# Altium schematic sheet SH5 - NETZER ENCODERS.SchDoc: Netzer Encoders
size B; CheckedBy: Lance Bantoto; DrawnBy: Kyle Hong; Engineer: Kyle Hong; Revision: 2; SheetNumber: 5; SheetTotal: 8
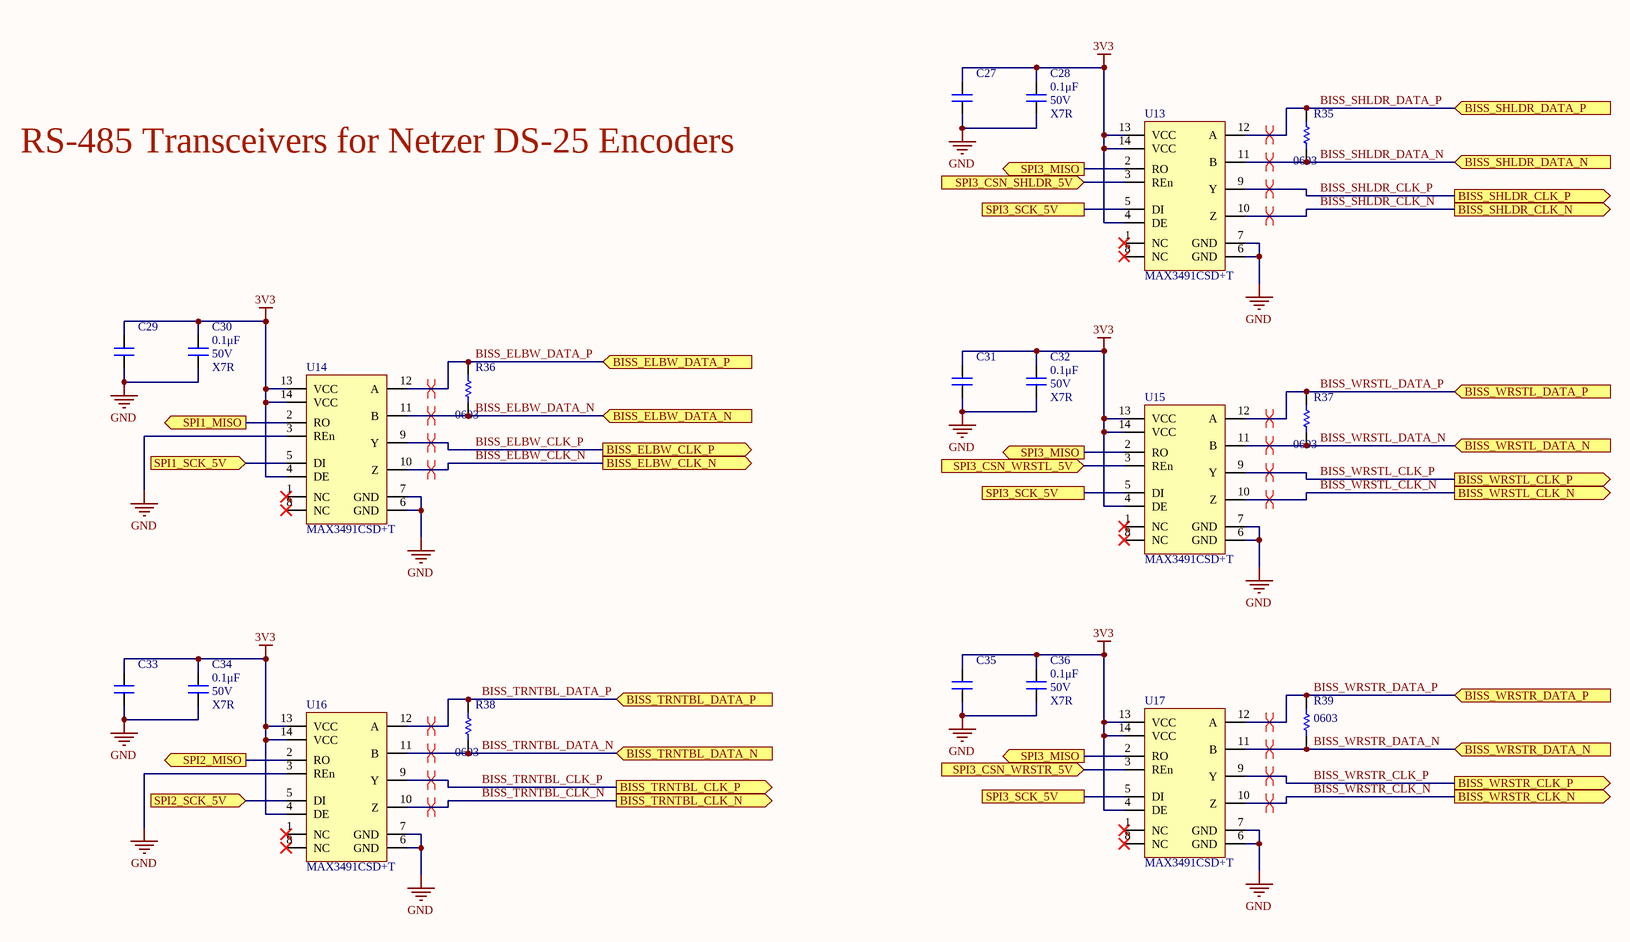
[diagram p0: SH5 - NETZER ENCODERS.SchDoc]

## Parts
C27  CAP_1uF_25V_0603  [CAP0603]  (value not drawn)
C28  value 0.1μF  Dielectric: X7R  Voltage Rating: 50V  [CAP0603]  (hidden comment: CAP_0.1uF_50V_0603)
C29  CAP_1uF_25V_0603  [CAP0603]  (value not drawn)
C30  value 0.1μF  Dielectric: X7R  Voltage Rating: 50V  [CAP0603]  (hidden comment: CAP_0.1uF_50V_0603)
C31  CAP_1uF_25V_0603  [CAP0603]  (value not drawn)
C32  value 0.1μF  Dielectric: X7R  Voltage Rating: 50V  [CAP0603]  (hidden comment: CAP_0.1uF_50V_0603)
C33  CAP_1uF_25V_0603  [CAP0603]  (value not drawn)
C34  value 0.1μF  Dielectric: X7R  Voltage Rating: 50V  [CAP0603]  (hidden comment: CAP_0.1uF_50V_0603)
C35  CAP_1uF_25V_0603  [CAP0603]  (value not drawn)
C36  value 0.1μF  Dielectric: X7R  Voltage Rating: 50V  [CAP0603]  (hidden comment: CAP_0.1uF_50V_0603)
R35  Package/Footprint: 0603  [RESC0603]  (hidden comment: RES_120Ω_0603_5%_HP)
R36  Package/Footprint: 0603  [RESC0603]  (hidden comment: RES_120Ω_0603_5%_HP)
R37  Package/Footprint: 0603  [RESC0603]  (hidden comment: RES_120Ω_0603_5%_HP)
R38  Package/Footprint: 0603  [RESC0603]  (hidden comment: RES_120Ω_0603_5%_HP)
R39  Package/Footprint: 0603  [RESC0603]  (hidden comment: RES_120Ω_0603_5%_HP)
U13  MAX3491  [MAX3491CSD+T]  (value not drawn)
U14  MAX3491  [MAX3491CSD+T]  (value not drawn)
U15  MAX3491  [MAX3491CSD+T]  (value not drawn)
U16  MAX3491  [MAX3491CSD+T]  (value not drawn)
U17  MAX3491  [MAX3491CSD+T]  (value not drawn)

## Ports
BISS_ELBW_CLK_N (out), BISS_ELBW_CLK_P (out), BISS_ELBW_DATA_N (in), BISS_ELBW_DATA_P (in), BISS_SHLDR_CLK_N (out), BISS_SHLDR_CLK_P (out), BISS_SHLDR_DATA_N (in), BISS_SHLDR_DATA_P (in), BISS_TRNTBL_CLK_N (out), BISS_TRNTBL_CLK_P (out), BISS_TRNTBL_DATA_N (in), BISS_TRNTBL_DATA_P (in), BISS_WRSTL_CLK_N (out), BISS_WRSTL_CLK_P (out), BISS_WRSTL_DATA_N (in), BISS_WRSTL_DATA_P (in), BISS_WRSTR_CLK_N (out), BISS_WRSTR_CLK_P (out), BISS_WRSTR_DATA_N (in), BISS_WRSTR_DATA_P (in), SPI1_MISO (out), SPI1_SCK_5V (in), SPI2_MISO (out), SPI2_SCK_5V (in), SPI3_CSN_SHLDR_5V (in), SPI3_CSN_WRSTL_5V (in), SPI3_CSN_WRSTR_5V (in), SPI3_MISO (out), SPI3_SCK_5V

## Nets
3V3: C27.2 C28.2 C29.2 C30.2 C31.2 C32.2 C33.2 C34.2 C35.2 C36.2 U13.4(DE) U13.13(VCC) U13.14(VCC) U14.4(DE) U14.13(VCC) U14.14(VCC) U15.4(DE) U15.13(VCC) U15.14(VCC) U16.4(DE) U16.13(VCC) U16.14(VCC) U17.4(DE) U17.13(VCC) U17.14(VCC)
GND: C27.1 C28.1 C29.1 C30.1 C31.1 C32.1 C33.1 C34.1 C35.1 C36.1 U13.6(GND) U13.7(GND) U14.3(REn) U14.6(GND) U14.7(GND) U15.6(GND) U15.7(GND) U16.3(REn) U16.6(GND) U16.7(GND) U17.6(GND) U17.7(GND)
BISS_ELBW_CLK_N: U14.10(Z) ; port BISS_ELBW_CLK_N
BISS_ELBW_CLK_P: U14.9(Y) ; port BISS_ELBW_CLK_P
BISS_ELBW_DATA_N: R36.1 U14.11(B) ; port BISS_ELBW_DATA_N
BISS_ELBW_DATA_P: R36.2 U14.12(A) ; port BISS_ELBW_DATA_P
BISS_SHLDR_CLK_N: U13.10(Z) ; port BISS_SHLDR_CLK_N
BISS_SHLDR_CLK_P: U13.9(Y) ; port BISS_SHLDR_CLK_P
BISS_SHLDR_DATA_N: R35.1 U13.11(B) ; port BISS_SHLDR_DATA_N
BISS_SHLDR_DATA_P: R35.2 U13.12(A) ; port BISS_SHLDR_DATA_P
BISS_TRNTBL_CLK_N: U16.10(Z) ; port BISS_TRNTBL_CLK_N
BISS_TRNTBL_CLK_P: U16.9(Y) ; port BISS_TRNTBL_CLK_P
BISS_TRNTBL_DATA_N: R38.1 U16.11(B) ; port BISS_TRNTBL_DATA_N
BISS_TRNTBL_DATA_P: R38.2 U16.12(A) ; port BISS_TRNTBL_DATA_P
BISS_WRSTL_CLK_N: U15.10(Z) ; port BISS_WRSTL_CLK_N
BISS_WRSTL_CLK_P: U15.9(Y) ; port BISS_WRSTL_CLK_P
BISS_WRSTL_DATA_N: R37.1 U15.11(B) ; port BISS_WRSTL_DATA_N
BISS_WRSTL_DATA_P: R37.2 U15.12(A) ; port BISS_WRSTL_DATA_P
BISS_WRSTR_CLK_N: U17.10(Z) ; port BISS_WRSTR_CLK_N
BISS_WRSTR_CLK_P: U17.9(Y) ; port BISS_WRSTR_CLK_P
BISS_WRSTR_DATA_N: R39.1 U17.11(B) ; port BISS_WRSTR_DATA_N
BISS_WRSTR_DATA_P: R39.2 U17.12(A) ; port BISS_WRSTR_DATA_P
SPI1_MISO: U14.2(RO) ; port SPI1_MISO
SPI1_SCK_5V: U14.5(DI) ; port SPI1_SCK_5V
SPI2_MISO: U16.2(RO) ; port SPI2_MISO
SPI2_SCK_5V: U16.5(DI) ; port SPI2_SCK_5V
SPI3_CSN_SHLDR_5V: U13.3(REn) ; port SPI3_CSN_SHLDR_5V
SPI3_CSN_WRSTL_5V: U15.3(REn) ; port SPI3_CSN_WRSTL_5V
SPI3_CSN_WRSTR_5V: U17.3(REn) ; port SPI3_CSN_WRSTR_5V
SPI3_MISO: U13.2(RO) U15.2(RO) U17.2(RO) ; port SPI3_MISO
SPI3_SCK_5V: U13.5(DI) U15.5(DI) U17.5(DI) ; port SPI3_SCK_5V

Not connected (* = marked no-connect by the designer): U13 1(NC)* 8(NC)*; U14 1(NC)* 8(NC)*; U15 1(NC)* 8(NC)*; U16 1(NC)* 8(NC)*; U17 1(NC)* 8(NC)*

## Layout directives
differential pair: BISS_ELBW_CLK_N, BISS_ELBW_CLK_P, BISS_ELBW_DATA_N, BISS_ELBW_DATA_P, BISS_SHLDR_CLK_N, BISS_SHLDR_CLK_P, BISS_SHLDR_DATA_N, BISS_SHLDR_DATA_P, BISS_TRNTBL_CLK_N, BISS_TRNTBL_CLK_P, BISS_TRNTBL_DATA_N, BISS_TRNTBL_DATA_P, BISS_WRSTL_CLK_N, BISS_WRSTL_CLK_P, BISS_WRSTL_DATA_N, BISS_WRSTL_DATA_P, BISS_WRSTR_CLK_N, BISS_WRSTR_CLK_P, BISS_WRSTR_DATA_N, BISS_WRSTR_DATA_P

## Notes on the sheet
- RS-485 Transceivers for Netzer DS-25 Encoders
- Title:
- Project:
- Date:
- Rev:
- Reviewer:
- Engineer:
- Sheet:
- of

## Library data of the parts
C27 C29 C31 C33 C35 = CAP_1uF_25V_0603: CAP CER 1UF 25V X5R 0603; Manufacturer 1: Samsung; Manufacturer Part Number 1: CL10A105KA8NNNC; Package/Footprint: 0603; Supplier 1: Digi-Key; Supplier Part Number 1: 1276-1102-1-ND; Mounting Type: SMD
C28 C30 C32 C34 C36 = CAP_0.1uF_50V_0603: CAP CER 0.1UF 50V X7R 0603; Manufacturer Part Number 1: CC0603KRX7R9BB104; Manufacturer 1: Yageo; Package/Footprint: 0603; Supplier Part Number 1: 311-1344-1-ND; Supplier 1: Digi-Key; Mounting Type: SMD
R35-R39 = RES_120Ω_0603_5%_HP: RES 120 OHM 5% 1/4W 0603; Manufacturer 1: Rohm; Manufacturer Part Number 1: ESR03EZPJ121; Supplier Part Number 1: RHM120DCT-ND; Supplier 1: Digi-Key; Mounting Type: SMD
U13-U17 = MAX3491: IC RS485 TRANSCEIVER FULL 1/1 14SOIC; Manufacturer 1: Maxim; Package/Footprint: 14-SOIC; Supplier 1: Digi-Key; Supplier Part Number 1: MAX3491CSD+CT-ND; Manufacturer Part Number 1: MAX3491CSD+T; Mounting Type: SMD